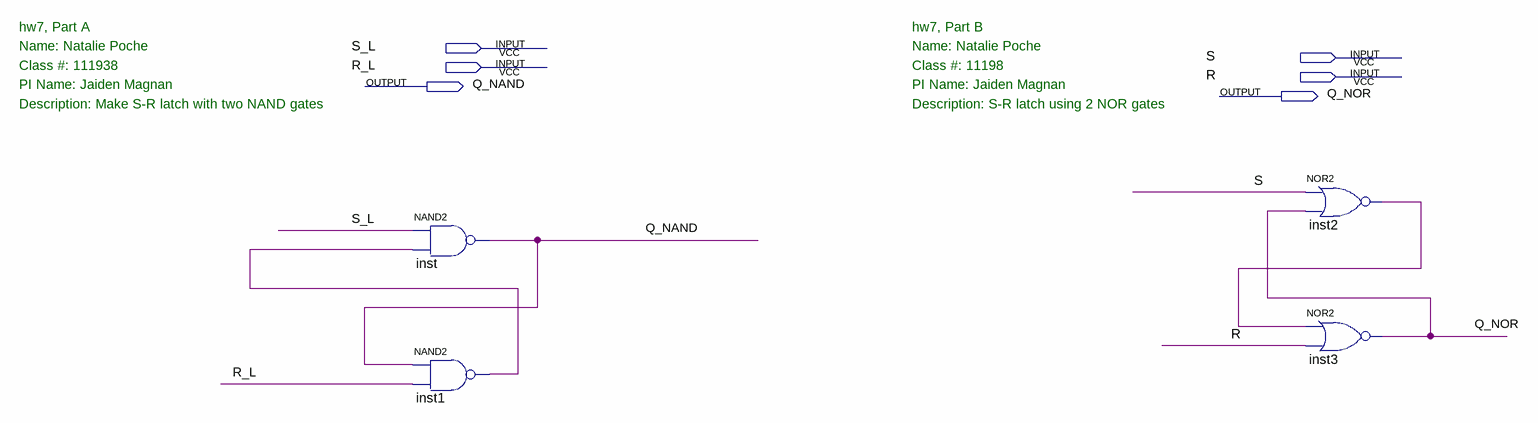
[diagram p0: schematic sheet]
// Quartus schematic hw7.bdf as structural Verilog: 4 symbols, 6 pins
module hw7 (
  input  S_L,
  input  S,
  input  R_L,
  input  R,
  output Q_NAND,
  output Q_NOR
);

  wire inst1_out, inst2_out;

  nand inst (Q_NAND, S_L, inst1_out);
  nand inst1 (inst1_out, Q_NAND, R_L);
  nor inst2 (inst2_out, S, Q_NOR);
  nor inst3 (Q_NOR, inst2_out, R);

  // Notes on the sheet:
  //   hw7, Part A
  //   hw7, Part B
  //   Name: Natalie Poche
  //   Name: Natalie Poche
  //   Class #: 111938
  //   Class #: 11198
  //   PI Name: Jaiden Magnan
  //   PI Name: Jaiden Magnan
  //   Description: Make S-R latch with two NAND gates
  //   Description: S-R latch using 2 NOR gates
endmodule
